# EasyEDA Pro project NeuralAccelerator_EasyEDA.epro, board Multiplier
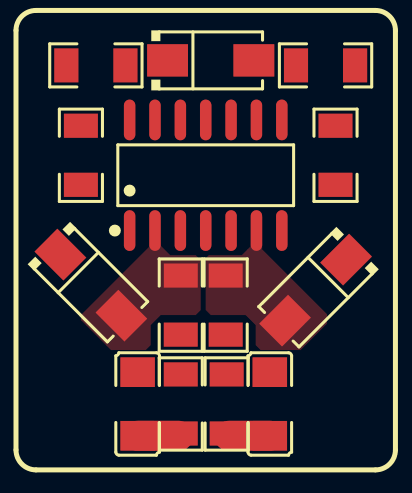
[diagram p8: board, top side]
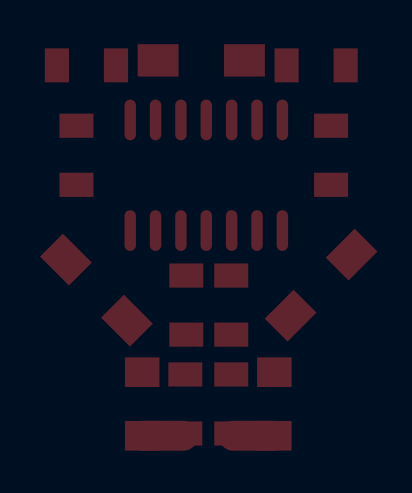
[diagram p9: board, bottom side, seen from below]

No outline. copper layers: Top Layer, Bottom Layer. Coordinates in mm from the lowest, leftmost part position.
Stack: Top Layer 0.035mm / Dielectric1 1.51mm FR4 er 4.5 / Bottom Layer 0.035mm

## Design rules (mm)
template: Custom Config
spacing copperThickness1oz (default): track to track 0.102, other pairs 0.152 to 0.3
spacing copperThickness2oz: track to track 0.203, other pairs 0.152 to 0.3
track width copperThickness1oz (default): min 0.127, default 0.254, max 2.54
track width copperThickness2oz: min 0.203, default 0.254, max 2.54
differential pair differentialPair (default): width min 0.127, default 0.254, max 2.54; gap min 0.152, default 0.152
via viaSize (default): diameter min 0.5, default 0.61, max 10; hole min 0.3, default 0.305, max 6.3

## Placement (name value [footprint] x y rotation side)
R1  6.2Ω  [R1206]  5 0 90 top
R2  6.2Ω  [R1206]  7.3 0 90 top
R7  50K±0.1%  [R1206]  5 4.95 270 top
R8  50K±0.1%  [R1206]  7.25 4.95 270 top
R9  50K±0.1%  [R1206]  0 12.45 270 top
R10  50K±0.1%  [R1206]  12.75 12.45 270 top
R11  50K±0.1%  [R1206]  12.25 16.95 0 top
R12  50K±0.1%  [R1206]  0.75 16.95 0 top
U1  12pF  [C1206]  2.84 0 270 top
U2  12pF  [C1206]  9.46 0 270 top
U6  TL084CDR  [SOIC-14_L8.7-W3.9-P1.27-LS6.0-BL]  6.25 11.45 0 top
U7  1N4007 M7  [SMA_L4.2-W2.7-LS5.3-RD]  0.5 5.95 315 top
U8  1N4007 M7  [SMA_L4.2-W2.7-LS5.3-RD]  11.75 5.7 225 top
U9  1N4007 M7  [SMA_L4.2-W2.7-LS5.3-RD]  6.5 17.2 0 top

## Footprints (pads in the part's own frame, mm; a bottom-side part is the same pattern mirrored in y, then rotated)
C1206
  rect 1.485x1.728 smd: 1(-1.593,0) 2(1.593,0)
R1206
  rect 1.208x1.701 smd: 1(-1.479,0) 2(1.479,0)
SMA_L4.2-W2.7-LS5.3-RD
  rect 2.046x1.62 smd: 1(-2.16,0) 2(2.16,0)
SOIC-14_L8.7-W3.9-P1.27-LS6.0-BL
  oval 0.574x2.038 smd: 1(-3.81,-2.769) 2(-2.54,-2.769) 3(-1.27,-2.769) 4(0,-2.769) 5(1.27,-2.769) 6(2.54,-2.769) 7(3.81,-2.769) 8(3.81,2.769) 9(2.54,2.769) 10(1.27,2.769) 11(0,2.769) 12(-1.27,2.769) 13(-2.54,2.769) 14(-3.81,2.769)

## Nets
As in the schematic, except:
VOUT: R12.1 U6.14

## Routing (per net, layer and track width the routed paths; a pad name or vN(x,y) marks a point on that pad's centre or on a via; arc(x,y) is an arc through that point)
V1: length 2
  Top Layer w1.5: U1.2 4.89,-1.59
V2: length 2
  Top Layer w1.5: U2.2 7.41,-1.59

## Copper pours and planes (outline as drawn; the poured copper is in the pictures)
VOUT on Top Layer: -1.56,18.28 0.42,18.28 1,17.7 1,15.7 1.25,15.45 2.5,15.45 2.75,15.2 2.75,13.2 1.85,13.2 1.85,13.99 1.08,14.76 -1.06,14.76 -1.56,15.26
$1N1615 on Top Layer: 0,9.42 6,9.42 6,2.7 0,2.7
$1N1657 on Top Layer: 6.25,9.35 12.32,9.35 12.32,2.7 6.25,2.7
$1N1729 on Top Layer: 9.78,7.04 12.32,4.49 14.57,6.74 14.57,10.6 13.6,11.58 11.9,11.58 9.78,9.45
$1N1735 on Top Layer: 2.72,7.17 0,4.45 -0.05,4.5 -0.28,4.5 -2.32,6.55 -2.32,10.1 -0.85,11.58 0.85,11.58 2.72,9.7
$1N1793 on Top Layer: -1.08,14.76 -1.56,14.28 -1.56,12.75 -1.01,12.2 1.11,12.2 1.86,11.45 11.25,11.45 11.75,11.95 13.5,11.95 14.5,12.95 14.56,18.28 12.25,18.28 12.25,15.7 11.25,14.7 11.25,13.2 11,12.95 9.5,12.95 9.25,13.2 9.25,15.2 9,15.45 8.5,15.45 8.25,15.2 8.25,13.2 8,12.95 1.85,12.95 1.85,13.99 1.08,14.76
$1N1839 on Top Layer: 9.78,14.42 9.78,15.05 9.15,15.67 7.3,15.67 6.85,16.12 6.85,17.95 7.38,18.48 11.5,18.48 11.9,18.08 11.9,16 11.47,15.58 10.93,15.58
$1N1881 on Top Layer: 3.43,15.03 2.75,15.7 1.32,15.7 1.32,18.35 6.25,18.35 6.25,16.2 5.25,16.2 4,15.03 4,13.55 3.43,14.12
$1N17644 on Top Layer: 3.92,4 4,4 4.1,4.1 5.9,4.1 6,4 6,0.9 5.9,0.8 4.02,0.8 3.92,0.9
$1N17777 on Top Layer: 6.27,4.04 6.27,0.87 6.4,0.8 8.23,0.8 8.33,0.9 8.33,4 8.23,4.1 6.41,4.1
